# EAGLE schematic Built-in (EAGLE 9.6.2)
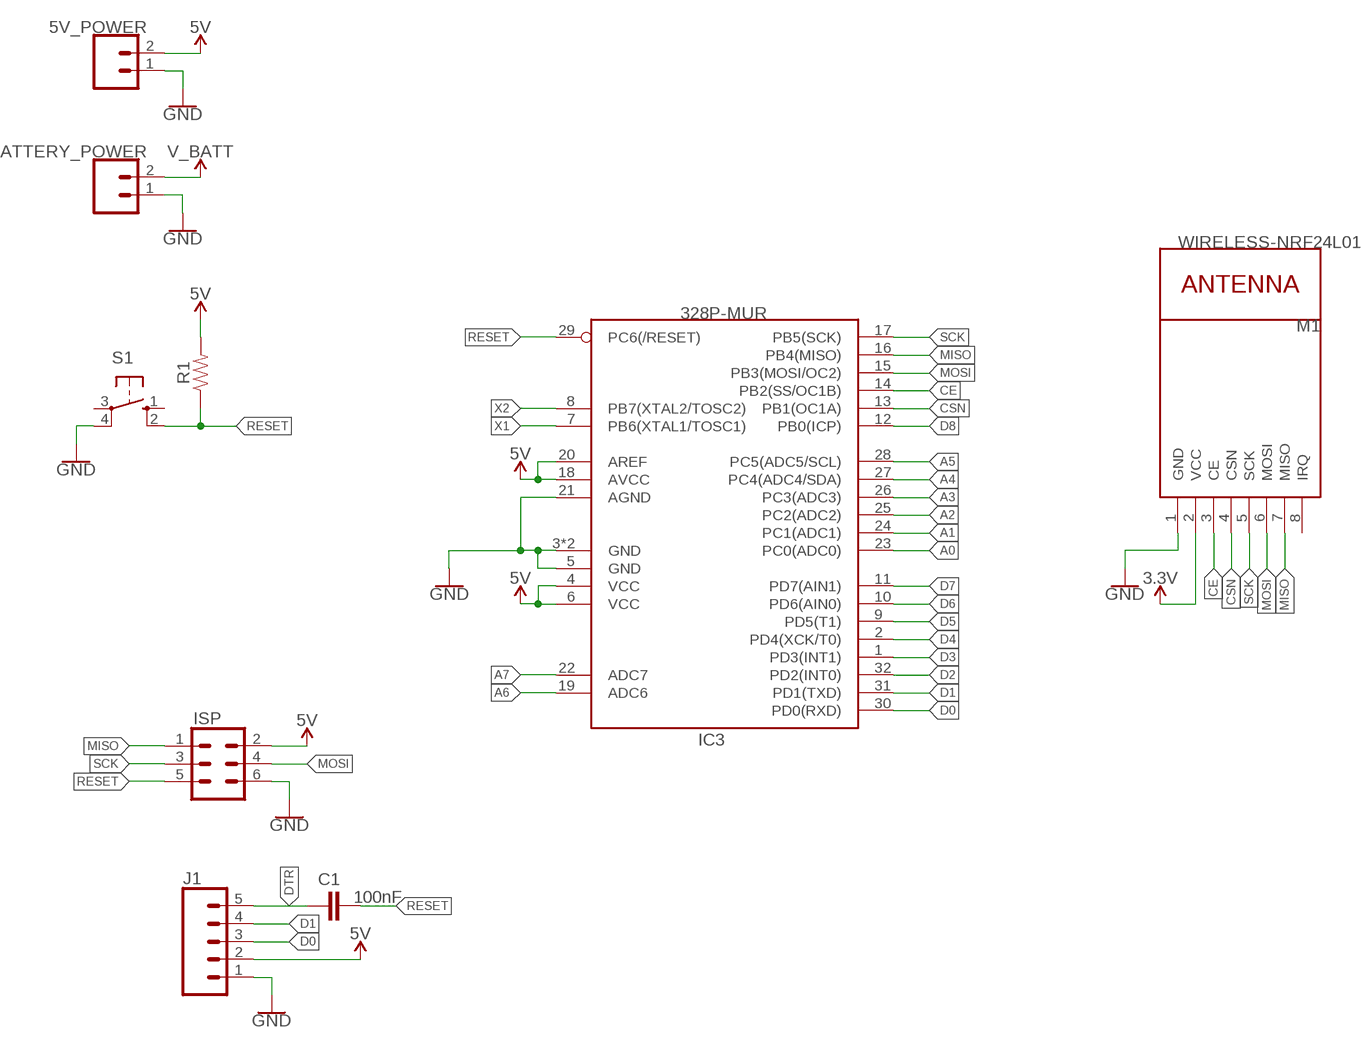
[diagram p0: schematic, sheet 1]

## Parts
5V_POWER  CONN_025MM  [SCREWTERMINAL-5MM-2]
BATTERY_POWER  CONN_025MM  [SCREWTERMINAL-5MM-2]
C1  100nF  10NF-0603-50V-10%  [0603]
IC3  328P-MUR  ATMEGA328P-32MUR  [VQFN32]
ISP  CONN_03X22X3_SILK_MALE_PTH  [2X3]
J1  CONN_05  [1X05]
M1  WIRELESS-NRF24L01  [WIRELESS-NRF24L01]
R1  RESISTOR0402  [0402]
S1  40-XX  [B3F-40XX]

## Nets
3.3V: M1.2(VCC)
5V: 5V_POWER.2 IC3.4(VCC) IC3.6(VCC) IC3.18(AVCC) IC3.20(AREF) ISP.2 J1.2 R1.2
A0: IC3.23(PC0(ADC0))
A1: IC3.24(PC1(ADC1))
A2: IC3.25(PC2(ADC2))
A3: IC3.26(PC3(ADC3))
A4: IC3.27(PC4(ADC4/SDA))
A5: IC3.28(PC5(ADC5/SCL))
A6: IC3.19(ADC6)
A7: IC3.22(ADC7)
CE: IC3.14(PB2(SS/OC1B)) M1.3(CE)
CSN: IC3.13(PB1(OC1A)) M1.4(CSN)
D0: IC3.30(PD0(RXD)) J1.3
D1: IC3.31(PD1(TXD)) J1.4
D2: IC3.32(PD2(INT0))
D3: IC3.1(PD3(INT1))
D4: IC3.2(PD4(XCK/T0))
D5: IC3.9(PD5(T1))
D6: IC3.10(PD6(AIN0))
D7: IC3.11(PD7(AIN1))
D8: IC3.12(PB0(ICP))
DTR: C1.1 J1.5
GND: 5V_POWER.1 BATTERY_POWER.1 IC3.3(GND) IC3.5(GND) IC3.21(AGND) IC3.33(GND) ISP.6 J1.1 M1.1(GND) S1.4(P1)
MISO: IC3.16(PB4(MISO)) ISP.1 M1.7(MISO)
MOSI: IC3.15(PB3(MOSI/OC2)) ISP.4 M1.6(MOSI)
RESET: C1.2 IC3.29(PC6(/RESET)) ISP.5 R1.1 S1.2(S1)
SCK: IC3.17(PB5(SCK)) ISP.3 M1.5(SCK)
V_BATT: BATTERY_POWER.2
X1: IC3.7(PB6(XTAL1/TOSC1))
X2: IC3.8(PB7(XTAL2/TOSC2))
Unconnected: M1.8(IRQ) S1.1(S) S1.3(P)

## Library data of the parts
5V_POWER BATTERY_POWER = SparkFun-Connectors:CONN_02: Multi connection point. Often used as Generic Header-pin footprint for 0.1 inch spaced/style header connections On any of the 0.1 inch spaced packages, you can populate with these: Break Away Headers - Straight <https://www.sparkfun.com/products/116> (PRT-00116) Break Away Male Headers - Right Angle <https://www.sparkfun.com/products/553> (PRT-00553) Female Headers <https://www.sparkfun.com/products/115> (PRT-00115) Break Away Headers - Machine Pin <https://www.sparkfun.com/products/117> (PRT-00117) Break Away Female Headers - Swiss Machine Pin <https://www.sparkfun.com/products/743> (PRT-00743) For SCREWTERMINALS and SPRING TERMINALS visit here: Screw Terimnals on SparkFun.com <https://www.sparkfun.com/search/results?term=Screw+Terminals> (5mm/3.5mm/2.54mm spacing) This device is also useful as a general connection point to wire up your design to another part of your project. Our various solder wires solder well into these plated through hole pads. Hook-Up Wire - Assortment (Stranded, 22 AWG) <https://www.sparkfun.com/products/11375> (PRT-11375) Hook-Up Wire - Assortment (Solid Core, 22 AWG) <https://www.sparkfun.com/products/11367> (PRT-11367) View the entire wire category on our website here <https://www.sparkfun.com/categories/141> Special notes: Molex polarized connector foot print use with: PRT-08233 with associated crimp pins and housings. 2.54_SCREWTERM for use with PRT-10571. 3.5mm Screw Terminal footprints for PRT-08084 5mm Screw Terminal footprints for use with PRT-08432; SF_SKU: PRT-08432
C1 = SparkFun-Capacitors:10NF: 0.01uF/10nF/10,000pF ceramic capacitors A capacitor is a passive two-terminal electrical component used to store electrical energy temporarily in an electric field. CAP-09321; PROD_ID: CAP-00867; VALUE: 10nF
IC3 = Arduino-ucs&SoCs:ATMEGA328P-32: 8-bit Microcontroller with 32KBytes In-System Programmable Flash ATMEGA328P-AU; DATASHEET: http://www.atmel.com/images/Atmel-8271-8-bit-AVR-Microcontroller-ATmega48A-48PA-88A-88PA-168A-168PA-328-328P_datasheet_Complete.pdf; DISTRIBUTOR-LINK: https://www.digikey.it/product-detail/it/microchip-technology/ATMEGA328P-MUR/ATMEGA328P-MURCT-ND/3440953; DISTRIBUTOR-PN: ATMEGA328P-MURCT-ND; MANUFACTURER: ATMEL; MANUFACTURER-PN: ATMEGA328P-MUR
ISP = SparkFun-Connectors:CONN_03X2: Multi connection point. Often used as Generic Header-pin footprint for 0.1 inch spaced/style header connections You can populate with any combo of single row headers, but if you'd like an exact match, check these: Header - 2x3 (Male, 0.1") <https://www.sparkfun.com/products/12807> (PRT-12807) Header - 2x3 (Female, 0.1") <https://www.sparkfun.com/products/13010> (PRT-13010) 2x3 Pin Shrouded Header <https://www.sparkfun.com/products/10877> (PRT-10877) On any of the 0.1 inch spaced packages, you can populate with these: Break Away Headers - Straight <https://www.sparkfun.com/products/116> (PRT-00116) Break Away Male Headers - Right Angle <https://www.sparkfun.com/products/553> (PRT-00553) Female Headers <https://www.sparkfun.com/products/115> (PRT-00115) Break Away Headers - Machine Pin <https://www.sparkfun.com/products/117> (PRT-00117) Break Away Female Headers - Swiss Machine Pin <https://www.sparkfun.com/products/743> (PRT-00743) Special note: the shrouded connector mates well with our 3x2 ribbon cables: Ribbon Crimp Connector - 6-pin (2x3, Female) <https://www.sparkfun.com/products/10651> (PRT-10651) Ribbon Cable - 6 wire (15ft) <https://www.sparkfun.com/products/10646> (PRT-10646); PROD_ID: CONN-09701
J1 = SparkFun-Connectors:CONN_05: Multi connection point. Often used as Generic Header-pin footprint for 0.1 inch spaced/style header connections On any of the 0.1 inch spaced packages, you can populate with these: Break Away Headers - Straight <https://www.sparkfun.com/products/116> (PRT-00116) Break Away Male Headers - Right Angle <https://www.sparkfun.com/products/553> (PRT-00553) Female Headers <https://www.sparkfun.com/products/115> (PRT-00115) Break Away Headers - Machine Pin <https://www.sparkfun.com/products/117> (PRT-00117) Break Away Female Headers - Swiss Machine Pin <https://www.sparkfun.com/products/743> (PRT-00743) For SCREWTERMINALS and SPRING TERMINALS visit here: Screw Terimnals on SparkFun.com <https://www.sparkfun.com/search/results?term=Screw+Terminals> (5mm/3.5mm/2.54mm spacing) This device is also useful as a general connection point to wire up your design to another part of your project. Our various solder wires solder well into these plated through hole pads. Hook-Up Wire - Assortment (Stranded, 22 AWG) <https://www.sparkfun.com/products/11375> (PRT-11375) Hook-Up Wire - Assortment (Solid Core, 22 AWG) <https://www.sparkfun.com/products/11367> (PRT-11367) View the entire wire category on our website here <https://www.sparkfun.com/categories/141> Special notes: Molex polarized connector foot print use with SKU : PRT-08231 with associated crimp pins and housings. 1MM SMD Version SKU: PRT-10208
M1 = diy-modules:WIRELESS-NRF24L01: 2.4 GHz Wireless Module based on NRF24L01 chip More details available here: http://www.electrodragon.com/w/NRF24L01 Click here to find device on ebay.com <http://www.ebay.com/sch/nrf24l01+arduino>
R1 = SparkFun-Resistors:RESISTOR: Generic Resistor Package
S1 = switch-omron:40-XX: OMRON SWITCH; MF: OMRON COMPONENTS USA; MPN: B3F-4000; OC_FARNELL: 176434; OC_NEWARK: 36K3105